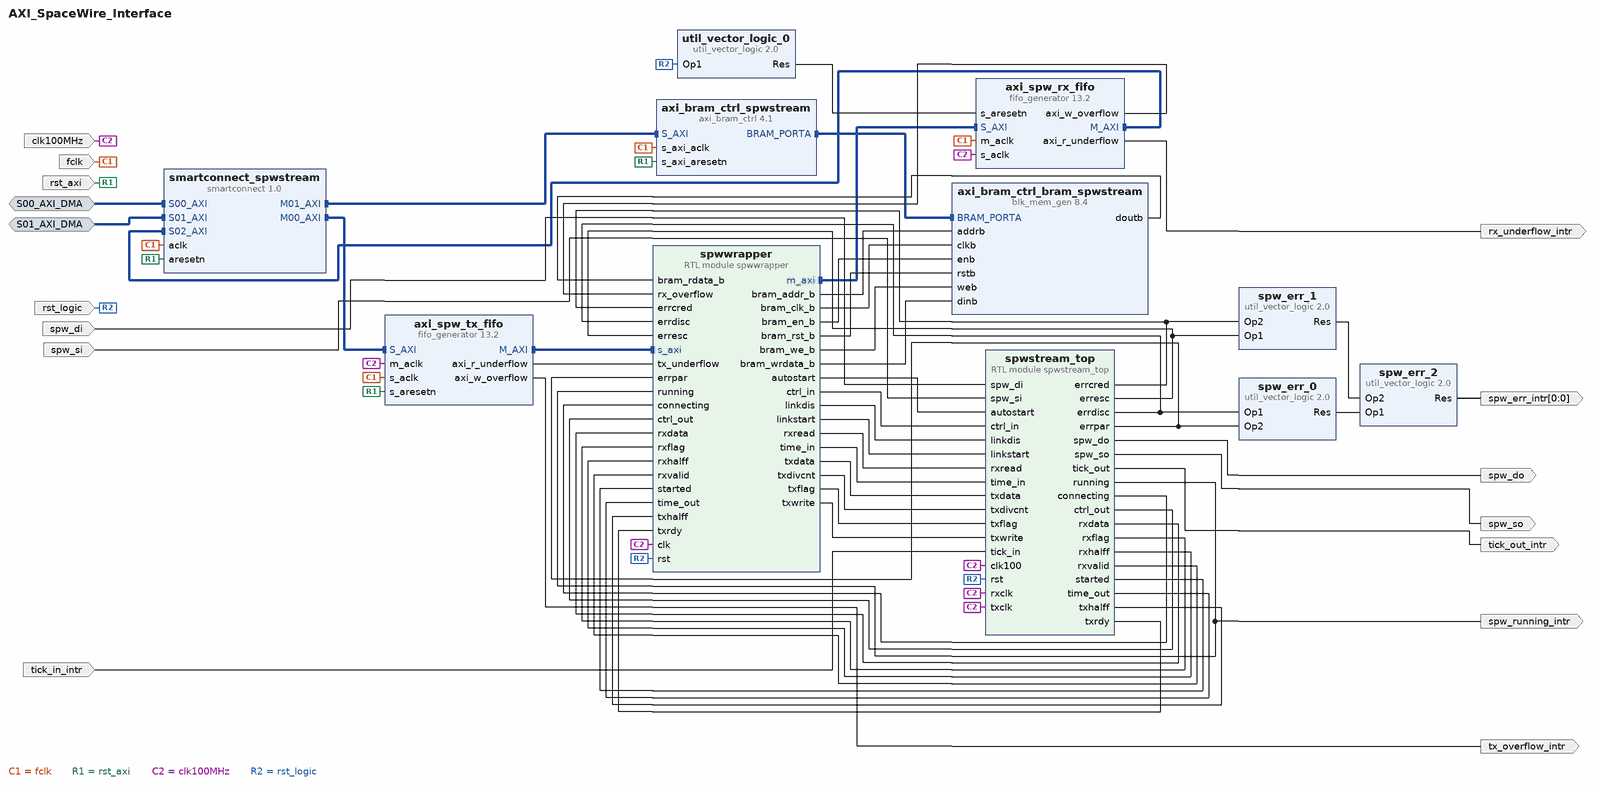
[diagram p0: block diagram of the top level]
# Vivado block design AXI_SpaceWire_Interface, xc7z045ffg900-2, Vivado 2022.1
create_bd_design AXI_SpaceWire_Interface

create_bd_intf_port -mode Slave -vlnv xilinx.com:interface:aximm_rtl:1.0 S00_AXI_DMA
set_property -dict [list \
  CONFIG.ADDR_WIDTH 32 \
  CONFIG.ARUSER_WIDTH 0 \
  CONFIG.AWUSER_WIDTH 0 \
  CONFIG.BUSER_WIDTH 0 \
  CONFIG.DATA_WIDTH 32 \
  CONFIG.HAS_BRESP 1 \
  CONFIG.HAS_BURST 1 \
  CONFIG.HAS_CACHE 1 \
  CONFIG.HAS_LOCK 1 \
  CONFIG.HAS_PROT 1 \
  CONFIG.HAS_QOS 1 \
  CONFIG.HAS_REGION 1 \
  CONFIG.HAS_RRESP 1 \
  CONFIG.HAS_WSTRB 1 \
  CONFIG.ID_WIDTH 0 \
  CONFIG.MAX_BURST_LENGTH 256 \
  CONFIG.NUM_READ_OUTSTANDING 1 \
  CONFIG.NUM_READ_THREADS 1 \
  CONFIG.NUM_WRITE_OUTSTANDING 1 \
  CONFIG.NUM_WRITE_THREADS 1 \
  CONFIG.PROTOCOL AXI4 \
  CONFIG.READ_WRITE_MODE READ_WRITE \
  CONFIG.RUSER_BITS_PER_BYTE 0 \
  CONFIG.RUSER_WIDTH 0 \
  CONFIG.SUPPORTS_NARROW_BURST 1 \
  CONFIG.WUSER_BITS_PER_BYTE 0 \
  CONFIG.WUSER_WIDTH 0 \
  CONFIG.master_id 1 \
] [get_bd_intf_ports S00_AXI_DMA]
create_bd_intf_port -mode Slave -vlnv xilinx.com:interface:aximm_rtl:1.0 S01_AXI_DMA
set_property -dict [list \
  CONFIG.ADDR_WIDTH 32 \
  CONFIG.ARUSER_WIDTH 0 \
  CONFIG.AWUSER_WIDTH 0 \
  CONFIG.BUSER_WIDTH 0 \
  CONFIG.DATA_WIDTH 32 \
  CONFIG.HAS_BRESP 1 \
  CONFIG.HAS_BURST 1 \
  CONFIG.HAS_CACHE 1 \
  CONFIG.HAS_LOCK 1 \
  CONFIG.HAS_PROT 1 \
  CONFIG.HAS_QOS 1 \
  CONFIG.HAS_REGION 1 \
  CONFIG.HAS_RRESP 1 \
  CONFIG.HAS_WSTRB 1 \
  CONFIG.ID_WIDTH 0 \
  CONFIG.MAX_BURST_LENGTH 256 \
  CONFIG.NUM_READ_OUTSTANDING 1 \
  CONFIG.NUM_READ_THREADS 1 \
  CONFIG.NUM_WRITE_OUTSTANDING 1 \
  CONFIG.NUM_WRITE_THREADS 1 \
  CONFIG.PROTOCOL AXI4 \
  CONFIG.READ_WRITE_MODE READ_WRITE \
  CONFIG.RUSER_BITS_PER_BYTE 0 \
  CONFIG.RUSER_WIDTH 0 \
  CONFIG.SUPPORTS_NARROW_BURST 1 \
  CONFIG.WUSER_BITS_PER_BYTE 0 \
  CONFIG.WUSER_WIDTH 0 \
  CONFIG.master_id 2 \
] [get_bd_intf_ports S01_AXI_DMA]
create_bd_port -dir I spw_di
create_bd_port -dir I spw_si
create_bd_port -dir O spw_do
create_bd_port -dir O spw_so
create_bd_port -dir I -type rst rst_logic
set_property -dict {CONFIG.POLARITY ACTIVE_HIGH} [get_bd_ports rst_logic]
create_bd_port -dir I -type clk fclk
create_bd_port -dir I -type rst rst_axi
create_bd_port -dir I clk100MHz
create_bd_port -dir O spw_running_intr
create_bd_port -dir O -from 0 -to 0 spw_err_intr
create_bd_port -dir O rx_underflow_intr
create_bd_port -dir O tx_overflow_intr
create_bd_port -dir I tick_in_intr
create_bd_port -dir O tick_out_intr

create_bd_cell -type ip -vlnv xilinx.com:ip:axi_bram_ctrl:4.1 axi_bram_ctrl_spwstream
set_property -dict {CONFIG.SINGLE_PORT_BRAM 1} [get_bd_cells axi_bram_ctrl_spwstream]
create_bd_cell -type ip -vlnv xilinx.com:ip:blk_mem_gen:8.4 axi_bram_ctrl_bram_spwstream
set_property -dict [list \
  CONFIG.Enable_B Use_ENB_Pin \
  CONFIG.Memory_Type True_Dual_Port_RAM \
  CONFIG.Port_B_Clock 100 \
  CONFIG.Port_B_Enable_Rate 100 \
  CONFIG.Port_B_Write_Rate 50 \
  CONFIG.Use_RSTB_Pin true \
] [get_bd_cells axi_bram_ctrl_bram_spwstream]
create_bd_cell -type ip -vlnv xilinx.com:ip:smartconnect:1.0 smartconnect_spwstream
set_property -dict {CONFIG.NUM_MI 2 CONFIG.NUM_SI 3} [get_bd_cells smartconnect_spwstream]
create_bd_cell -type ip -vlnv xilinx.com:ip:fifo_generator:13.2 axi_spw_rx_fifo
set_property -dict [list \
  CONFIG.Clock_Type_AXI Independent_Clock \
  CONFIG.DATA_WIDTH 32 \
  CONFIG.Enable_Safety_Circuit true \
  CONFIG.FIFO_Implementation_axis Independent_Clocks_Block_RAM \
  CONFIG.FIFO_Implementation_rach Independent_Clocks_Distributed_RAM \
  CONFIG.FIFO_Implementation_rdch Independent_Clocks_Block_RAM \
  CONFIG.FIFO_Implementation_wach Independent_Clocks_Distributed_RAM \
  CONFIG.FIFO_Implementation_wdch Independent_Clocks_Block_RAM \
  CONFIG.FIFO_Implementation_wrch Independent_Clocks_Distributed_RAM \
  CONFIG.Full_Flags_Reset_Value 1 \
  CONFIG.INTERFACE_TYPE AXI_MEMORY_MAPPED \
  CONFIG.Overflow_Flag_AXI true \
  CONFIG.PROTOCOL AXI4_Lite \
  CONFIG.Underflow_Flag_AXI true \
] [get_bd_cells axi_spw_rx_fifo]
create_bd_cell -type ip -vlnv xilinx.com:ip:fifo_generator:13.2 axi_spw_tx_fifo
set_property -dict [list \
  CONFIG.Clock_Type_AXI Independent_Clock \
  CONFIG.DATA_WIDTH 32 \
  CONFIG.Enable_Safety_Circuit true \
  CONFIG.FIFO_Implementation_axis Independent_Clocks_Block_RAM \
  CONFIG.FIFO_Implementation_rach Independent_Clocks_Distributed_RAM \
  CONFIG.FIFO_Implementation_rdch Independent_Clocks_Block_RAM \
  CONFIG.FIFO_Implementation_wach Independent_Clocks_Distributed_RAM \
  CONFIG.FIFO_Implementation_wdch Independent_Clocks_Block_RAM \
  CONFIG.FIFO_Implementation_wrch Independent_Clocks_Distributed_RAM \
  CONFIG.Full_Flags_Reset_Value 1 \
  CONFIG.INTERFACE_TYPE AXI_MEMORY_MAPPED \
  CONFIG.Input_Depth_wach 16 \
  CONFIG.Overflow_Flag_AXI true \
  CONFIG.PROTOCOL AXI4_Lite \
  CONFIG.Underflow_Flag_AXI true \
] [get_bd_cells axi_spw_tx_fifo]
create_bd_cell -type ip -vlnv xilinx.com:ip:util_vector_logic:2.0 spw_err_0
set_property -dict {CONFIG.C_OPERATION or CONFIG.C_SIZE 1} [get_bd_cells spw_err_0]
create_bd_cell -type ip -vlnv xilinx.com:ip:util_vector_logic:2.0 spw_err_1
set_property -dict {CONFIG.C_OPERATION or CONFIG.C_SIZE 1} [get_bd_cells spw_err_1]
create_bd_cell -type ip -vlnv xilinx.com:ip:util_vector_logic:2.0 spw_err_2
set_property -dict {CONFIG.C_OPERATION or CONFIG.C_SIZE 1} [get_bd_cells spw_err_2]
create_bd_cell -type module -reference spwstream_top spwstream_top
create_bd_cell -type ip -vlnv xilinx.com:ip:util_vector_logic:2.0 util_vector_logic_0
set_property -dict {CONFIG.C_OPERATION not CONFIG.C_SIZE 1} [get_bd_cells util_vector_logic_0]
create_bd_cell -type module -reference spwwrapper spwwrapper

# ---- connections ----

connect_bd_intf_net -intf_net S00_AXI_0_1 [get_bd_intf_ports S00_AXI_DMA] [get_bd_intf_pins smartconnect_spwstream/S00_AXI]
connect_bd_intf_net -intf_net S01_AXI_0_1 [get_bd_intf_ports S01_AXI_DMA] [get_bd_intf_pins smartconnect_spwstream/S01_AXI]
connect_bd_intf_net -intf_net axi_bram_ctrl_0_BRAM_PORTA [get_bd_intf_pins axi_bram_ctrl_bram_spwstream/BRAM_PORTA] [get_bd_intf_pins axi_bram_ctrl_spwstream/BRAM_PORTA]
connect_bd_intf_net [get_bd_intf_pins axi_spw_rx_fifo/M_AXI] [get_bd_intf_pins smartconnect_spwstream/S02_AXI]
connect_bd_intf_net [get_bd_intf_pins spwwrapper/s_axi] [get_bd_intf_pins axi_spw_tx_fifo/M_AXI]
connect_bd_intf_net [get_bd_intf_pins axi_spw_tx_fifo/S_AXI] [get_bd_intf_pins smartconnect_spwstream/M00_AXI]
connect_bd_intf_net [get_bd_intf_pins axi_bram_ctrl_spwstream/S_AXI] [get_bd_intf_pins smartconnect_spwstream/M01_AXI]
connect_bd_intf_net [get_bd_intf_pins spwwrapper/m_axi] [get_bd_intf_pins axi_spw_rx_fifo/S_AXI]
connect_bd_net -net aclk_0_1 [get_bd_ports fclk] \
  [get_bd_pins smartconnect_spwstream/aclk] [get_bd_pins axi_bram_ctrl_spwstream/s_axi_aclk] \
  [get_bd_pins axi_spw_rx_fifo/m_aclk] [get_bd_pins axi_spw_tx_fifo/s_aclk]
connect_bd_net -net aresetn_0_1 [get_bd_ports rst_axi] \
  [get_bd_pins smartconnect_spwstream/aresetn] [get_bd_pins axi_bram_ctrl_spwstream/s_axi_aresetn] \
  [get_bd_pins axi_spw_tx_fifo/s_aresetn]
connect_bd_net [get_bd_pins axi_bram_ctrl_bram_spwstream/doutb] [get_bd_pins spwwrapper/bram_rdata_b]
connect_bd_net [get_bd_pins axi_spw_rx_fifo/axi_r_underflow] [get_bd_ports rx_underflow_intr]
connect_bd_net [get_bd_pins axi_spw_rx_fifo/axi_w_overflow] [get_bd_pins spwwrapper/rx_overflow]
connect_bd_net [get_bd_pins axi_spw_tx_fifo/axi_r_underflow] [get_bd_pins spwwrapper/tx_underflow]
connect_bd_net [get_bd_pins axi_spw_tx_fifo/axi_w_overflow] [get_bd_ports tx_overflow_intr]
connect_bd_net -net clk100_1 [get_bd_ports clk100MHz] \
  [get_bd_pins spwstream_top/clk100] [get_bd_pins spwstream_top/txclk] [get_bd_pins spwstream_top/rxclk] \
  [get_bd_pins axi_spw_rx_fifo/s_aclk] [get_bd_pins axi_spw_tx_fifo/m_aclk] [get_bd_pins spwwrapper/clk]
connect_bd_net [get_bd_ports rst_logic] [get_bd_pins spwstream_top/rst] [get_bd_pins util_vector_logic_0/Op1] [get_bd_pins spwwrapper/rst]
connect_bd_net -net spw_di_0_1 [get_bd_ports spw_di] [get_bd_pins spwstream_top/spw_di]
connect_bd_net -net spw_si_0_1 [get_bd_ports spw_si] [get_bd_pins spwstream_top/spw_si]
connect_bd_net -net spwstream_top_0_errcred [get_bd_pins spwstream_top/errcred] [get_bd_pins spw_err_1/Op2] [get_bd_pins spwwrapper/errcred]
connect_bd_net -net spwstream_top_0_errdisc [get_bd_pins spwstream_top/errdisc] [get_bd_pins spw_err_0/Op1] [get_bd_pins spwwrapper/errdisc]
connect_bd_net -net spwstream_top_0_erresc [get_bd_pins spwstream_top/erresc] [get_bd_pins spw_err_1/Op1] [get_bd_pins spwwrapper/erresc]
connect_bd_net -net spwstream_top_0_errpar [get_bd_pins spwstream_top/errpar] [get_bd_pins spw_err_0/Op2] [get_bd_pins spwwrapper/errpar]
connect_bd_net -net spwstream_top_0_running [get_bd_pins spwstream_top/running] [get_bd_ports spw_running_intr] [get_bd_pins spwwrapper/running]
connect_bd_net -net spwstream_top_0_spw_do [get_bd_pins spwstream_top/spw_do] [get_bd_ports spw_do]
connect_bd_net -net spwstream_top_0_spw_so [get_bd_pins spwstream_top/spw_so] [get_bd_ports spw_so]
connect_bd_net [get_bd_pins spwstream_top/connecting] [get_bd_pins spwwrapper/connecting]
connect_bd_net [get_bd_pins spwstream_top/ctrl_out] [get_bd_pins spwwrapper/ctrl_out]
connect_bd_net [get_bd_pins spwstream_top/rxdata] [get_bd_pins spwwrapper/rxdata]
connect_bd_net [get_bd_pins spwstream_top/rxflag] [get_bd_pins spwwrapper/rxflag]
connect_bd_net [get_bd_pins spwstream_top/rxhalff] [get_bd_pins spwwrapper/rxhalff]
connect_bd_net [get_bd_pins spwstream_top/rxvalid] [get_bd_pins spwwrapper/rxvalid]
connect_bd_net [get_bd_pins spwstream_top/started] [get_bd_pins spwwrapper/started]
connect_bd_net [get_bd_pins spwstream_top/tick_out] [get_bd_ports tick_out_intr]
connect_bd_net [get_bd_pins spwstream_top/time_out] [get_bd_pins spwwrapper/time_out]
connect_bd_net [get_bd_pins spwstream_top/txhalff] [get_bd_pins spwwrapper/txhalff]
connect_bd_net [get_bd_pins spwstream_top/txrdy] [get_bd_pins spwwrapper/txrdy]
connect_bd_net [get_bd_pins spwwrapper/autostart] [get_bd_pins spwstream_top/autostart]
connect_bd_net [get_bd_pins spwwrapper/bram_addr_b] [get_bd_pins axi_bram_ctrl_bram_spwstream/addrb]
connect_bd_net [get_bd_pins spwwrapper/bram_clk_b] [get_bd_pins axi_bram_ctrl_bram_spwstream/clkb]
connect_bd_net [get_bd_pins spwwrapper/bram_en_b] [get_bd_pins axi_bram_ctrl_bram_spwstream/enb]
connect_bd_net [get_bd_pins spwwrapper/bram_rst_b] [get_bd_pins axi_bram_ctrl_bram_spwstream/rstb]
connect_bd_net [get_bd_pins spwwrapper/bram_we_b] [get_bd_pins axi_bram_ctrl_bram_spwstream/web]
connect_bd_net [get_bd_pins spwwrapper/bram_wrdata_b] [get_bd_pins axi_bram_ctrl_bram_spwstream/dinb]
connect_bd_net [get_bd_pins spwwrapper/ctrl_in] [get_bd_pins spwstream_top/ctrl_in]
connect_bd_net [get_bd_pins spwwrapper/linkdis] [get_bd_pins spwstream_top/linkdis]
connect_bd_net [get_bd_pins spwwrapper/linkstart] [get_bd_pins spwstream_top/linkstart]
connect_bd_net [get_bd_pins spwwrapper/rxread] [get_bd_pins spwstream_top/rxread]
connect_bd_net [get_bd_pins spwwrapper/time_in] [get_bd_pins spwstream_top/time_in]
connect_bd_net [get_bd_pins spwwrapper/txdata] [get_bd_pins spwstream_top/txdata]
connect_bd_net [get_bd_pins spwwrapper/txdivcnt] [get_bd_pins spwstream_top/txdivcnt]
connect_bd_net [get_bd_pins spwwrapper/txflag] [get_bd_pins spwstream_top/txflag]
connect_bd_net [get_bd_pins spwwrapper/txwrite] [get_bd_pins spwstream_top/txwrite]
connect_bd_net -net tick_in_0_1 [get_bd_ports tick_in_intr] [get_bd_pins spwstream_top/tick_in]
connect_bd_net -net util_vector_logic_0_Res [get_bd_pins spw_err_0/Res] [get_bd_pins spw_err_2/Op1]
connect_bd_net [get_bd_pins util_vector_logic_0/Res] [get_bd_pins axi_spw_rx_fifo/s_aresetn]
connect_bd_net -net util_vector_logic_1_Res [get_bd_pins spw_err_1/Res] [get_bd_pins spw_err_2/Op2]
connect_bd_net -net util_vector_logic_2_Res [get_bd_pins spw_err_2/Res] [get_bd_ports spw_err_intr]

validate_bd_design
save_bd_design
